# EAGLE design board (EAGLE 9.6.2)
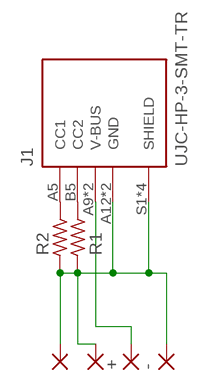
[diagram p0: schematic, sheet 1]

## Parts
+  1,6/0,9  [1,6/0,9]
-  1,6/0,9  [1,6/0,9]
J1  UJC-HP-3-SMT-TR  [CUI_UJC-HP-3-SMT-TR]
PAD1  1,6/0,9  [1,6/0,9]
PAD4  1,6/0,9  [1,6/0,9]
R1  R_0402  [R0402]
R2  R_0402  [R0402]

## Nets
GND: -.1(P) J1.A12(GND) J1.B12(GND) J1.S1(SHIELD) J1.S2(SHIELD) J1.S3(SHIELD) J1.S4(SHIELD) PAD1.1(P) PAD4.1(P) R1.1 R2.1
N$1: J1.A5(CC1) R2.2
N$2: J1.B5(CC2) R1.2
VCC: +.1(P) J1.A9(V-BUS) J1.B9(V-BUS)

## Library data of the parts
+ - PAD1 PAD4 = wirepad:1,6/0,9: THROUGH-HOLE PAD
J1 = UJC-HP-3-SMT-TR:UJC-HP-3-SMT-TR: USB RECEPTACLE; AVAILABILITY: Unavailable; CUI_PURCHASE_URL: https://www.cuidevices.com/product/interconnect/connectors/usb-connectors/ujc-hp-3-smt-tr?utm_source=snapeda.com&utm_medium=referral&utm_campaign=snapedaBOM; DESCRIPTION: Type C, 3 A, Right Angle, Surface Mount (SMT), Power Only USB Receptacle; DIGIKEY-PURCHASE-URL: https://snapeda.com/shop?store=DigiKey&id=4722774; MF: CUI Devices; MP: UJC-HP-3-SMT-TR; PACKAGE: Package; PRICE: None
R1 R2 = rc-master-smd:R_: RESISTOR

## Board
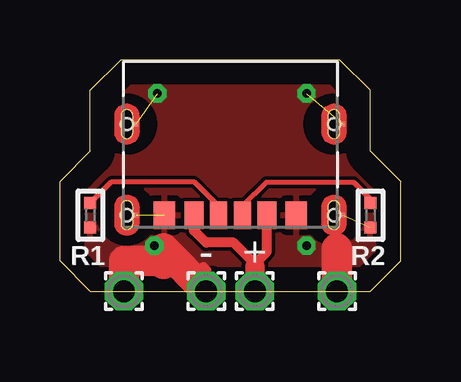
[diagram p1: board, top side]
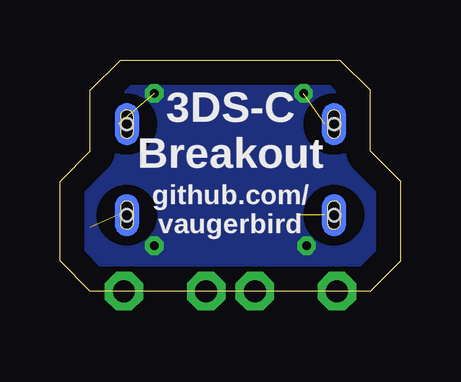
[diagram p2: board, bottom side, seen from below]

Size 14.22 x 9.65 mm. Coordinates in mm from the lower left corner, seen from the top.
Outline: 11.68,9.65 2.54,9.65 1.27,8.38 1.27,5.84 0,4.57 0,1.27 1.27,0 12.95,0 14.22,1.27 14.22,4.57 12.95,5.84 12.95,8.38 11.68,9.65
Copper layers (1*16): Top 0.035mm / dielectric 1.5mm / Bottom 0.035mm
Design rules "default": minimum track width 6mil, minimum drill 0.35mm, track to track 6mil, track to pad 6mil, pad to pad 6mil, via to via 6mil, smd to smd 6mil, copper to edge 40mil, drill to drill 6mil, minimum pad ring 10mil, minimum via ring 8mil, stop-mask expansion 4mil, vias tented up to drill 0mil, thermal gap 10mil

### Footprints (pad centres in the part's own frame; a part is rotated, then mirrored left to right if it is on the bottom)
1,6/0,9 = drill 0.914 pad 1.6 octagon: 1 0,0
CUI_UJC-HP-3-SMT-TR = smd 0.7 x 1.15: A5 -0.5,0; B5 0.5,0 | smd 0.8 x 1.15: A9 1.52,0; B9 -1.52,0 | smd 0.9 x 1.15: A12 2.75,0; B12 -2.75,0 | smd 0.2 x 0.2: S1 -4.695,0; S2 3.945,0; S3 -4.695,-3.8; S4 3.945,-3.8 | hole 0.5: -4.32,0; 4.32,0; -4.32,-3.8; 4.32,-3.8
R0402 = smd 0.5 x 0.5: 1 -0.508,0; 2 0.508,0

### Placement (x,y rotation side)
+  8.13,0 0 top
-  6.1,0 0 top
J1  7.11,3.17 180 top
PAD1  2.67,0 0 top
PAD4  11.56,0 0 top
R1  1.27,3.17 90 top
R2  12.95,3.17 90 top

### Tracks (layer width: path | path; a pad name or v marks a point on that pad's centre or on a via)
GND  (via drill 0.35)  (4 unrouted)
  Top 0.406: 6.1,0.89 5.97,1.02
  Top 1.27: PAD1.1 2.67,1.27 4.32,1.27 | PAD4.1 11.56,1.78 | 4.32,1.14 4.32,1.27 | 4.32,1.27 4.32,1.78 -.1
  other vias: 10.29,8.25 3.94,1.9 10.29,1.9 4.06,8.25
  pour Top: -0.51,9.65 -0.51,0 14.73,0 14.73,9.65
  pour Bottom: 14.73,9.65 14.73,0 -0.51,0 -0.51,9.65
N$1
  Top 0.203: R2.2 12.95,3.84 12.25,4.54 8.61,4.54 7.61,3.55 J1.A5
N$2
  Top 0.203: R1.2 2.16,4.57 5.59,4.57 6.61,3.55 J1.B5
VCC
  Top 0.406: 8.13,1.14 8.19,1.08 8.13,1.02 | 8.13,1.14 7.24,2.03 6.1,2.03 5.59,2.54 J1.A9 | J1.B9 8.63,1.65 8.13,1.14
  Top 0.813: +.1 8.13,1.02

### Text on the board
bNames: 3DS-C / Breakout | github.com/ / vaugerbird